# Altium schematic sheet PIC.SchDoc
size A
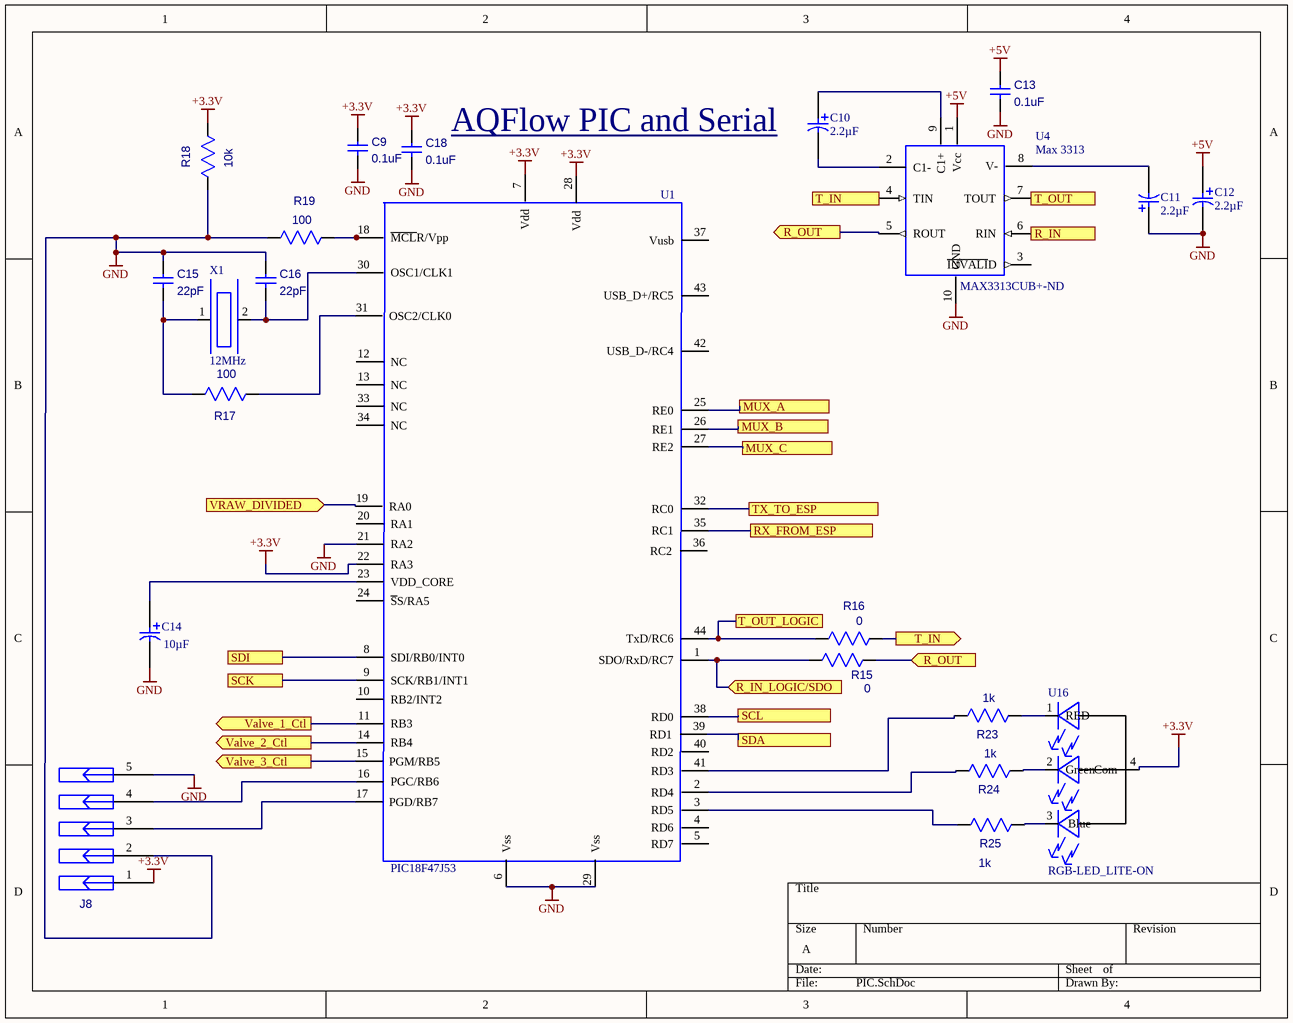
[diagram p0: PIC.SchDoc]

## Parts
C9  value 0.1uF  [CC1206]  (hidden comment: CC1206)
C10  Capacitance: 2.2µF  [Cap_Pol_0805]  (hidden comment: Cap_Pol_0805)
C11  Capacitance: 2.2µF  [Cap_Pol_0805]  (hidden comment: Cap_Pol_0805)
C12  Capacitance: 2.2µF  [Cap_Pol_0805]  (hidden comment: Cap_Pol_0805)
C13  value 0.1uF  [CC1206]  (hidden comment: CC1206)
C14  Capacitance: 10µF  [Cap_Pol_0805]  (hidden comment: CAP_POL_0805 Generic)
C15  value 22pF  [CC1206]  (hidden comment: CC1206)
C16  value 22pF  [CC1206]  (hidden comment: CC1206)
C18  value 0.1uF  [CC1206]  (hidden comment: CC1206)
J8  HDR_MTA_5X100  [HDR_MTA_5X100]  (value not drawn)
R15  value 0  [RC1206]  (hidden comment: RC1206)
R16  value 0  [RC1206]  (hidden comment: RC1206)
R17  value 100  [RC1206]  (hidden comment: RC1206)
R18  value 10k  [RC1206]  (hidden comment: RC1206)
R19  value 100  [RC1206]  (hidden comment: RC1206)
R23  value 1k  [RC1206]  (hidden comment: RC1206)
R24  value 1k  [RC1206]  (hidden comment: RC1206)
R25  value 1k  [RC1206]  (hidden comment: RC1206)
U1  PIC18F47J53  [44-TQFP]
U4  Max 3313  Supplier Part Number 1: MAX3313CUB+-ND  [uSOP]
U16  RGB-LED_LITE-ON  [LTST-C19HE1WT]
X1  12MHz  [XTAL_MINI_ABM3]

## Ports
MUX_A, MUX_B, MUX_C, R_IN (in), R_IN_LOGIC/SDO (in), R_OUT (in), R_OUT (out), RX_FROM_ESP, SCK, SCL, SDA, SDI, T_IN (in), T_IN (out), T_OUT (out), T_OUT_LOGIC, TX_TO_ESP, Valve_1_Ctl (out), Valve_2_Ctl (out), Valve_3_Ctl (out), VRAW_DIVIDED (in)

## Nets
+3.3V: C9.1 C18.1 J8.1 R18.1 U1.7(Vdd) U1.22(RA3) U1.28(Vdd) U16.4(Com)
+5V: C12.plus C13.1 U4.1(Vcc)
GND: C9.2 C11.plus C12.minus C13.2 C14.minus C15.1 C16.1 C18.2 J8.2 J8.5 R18.2 R19.1 U1.6(Vss) U1.21(RA2) U1.29(Vss) U4.10(GND)
MUX_A: U1.25(RE0) ; port MUX_A
MUX_B: U1.26(RE1) ; port MUX_B
MUX_C: U1.27(RE2) ; port MUX_C
R_IN: U4.6(RIN) ; port R_IN
R_IN_LOGIC/SDO: R15.1 U1.1(SDO/RxD/RC7) ; port R_IN_LOGIC/SDO
R_OUT: R15.2 U4.5(ROUT) ; port R_OUT
RX_FROM_ESP: U1.35(RC1) ; port RX_FROM_ESP
SCK: U1.9(SCK/RB1/INT1) ; port SCK
SCL: U1.38(RD0) ; port SCL
SDA: U1.39(RD1) ; port SDA
SDI: U1.8(SDI/RB0/INT0) ; port SDI
T_IN: R16.2 U4.4(TIN) ; port T_IN
T_OUT: U4.7(TOUT) ; port T_OUT
T_OUT_LOGIC: R16.1 U1.44(TxD/RC6) ; port T_OUT_LOGIC
TX_TO_ESP: U1.32(RC0) ; port TX_TO_ESP
Valve_1_Ctl: U1.11(RB3) ; port Valve_1_Ctl
Valve_2_Ctl: U1.14(RB4) ; port Valve_2_Ctl
Valve_3_Ctl: U1.15(PGM/RB5) ; port Valve_3_Ctl
VRAW_DIVIDED: U1.19(RA0) ; port VRAW_DIVIDED
NetC10_minus: C10.minus U4.2(C1-)
NetC10_plus: C10.plus U4.9(C1+)
NetC11_minus: C11.minus U4.8(V-)
NetC14_plus: C14.plus U1.23(VDD_CORE)
NetC15_2: C15.2 R17.1 X1.1
NetC16_2: C16.2 U1.30(OSC1/CLK1) X1.2
NetJ8_3: J8.3 U1.17(PGD/RB7)
NetJ8_4: J8.4 U1.16(PGC/RB6)
NetR17_2: R17.2 U1.31(OSC2/CLK0)
NetR19_2: R19.2 U1.18(~{MCL}R/Vpp)
NetR23_1: R23.1 U1.41(RD3)
NetR23_2: R23.2 U16.1(RED)
NetR24_1: R24.1 U1.2(RD4)
NetR24_2: R24.2 U16.2(Green)
NetR25_1: R25.1 U1.3(RD5)
NetR25_2: R25.2 U16.3(Blue)

Not connected (* = marked no-connect by the designer): U1 4(RD6) 5(RD7) 10(RB2/INT2) 12(NC) 13(NC) 20(RA1) 24(~{S}S/RA5) 33(NC) 34(NC) 36(RC2) 37(Vusb) 40(RD2) 42(USB_D-/RC4) 43(USB_D+/RC5); U4 3(~{INVALI}D)

## Notes on the sheet
- (near C10) AQFlow PIC and Serial

## Library data of the parts
C10-C12 = Cap_Pol_0805: Manufacturer: AVX Corporation; Manufacturer Part Number: TAJR225K020RNJ; Manufacturer Size Code: R; Tolerance: ±10%; Voltage - Rated: 20V; ESR (Equivalent Series Resistance): 6 Ohm; Type: Molded; Supplier 1: Digi-Key; RoHS: RoHS Compliant; Category: Capacitors; Stock 1: 9954; Pricing 1: 1=1.24, 10=1.034, 100=0.66, 250=0.55, 500=0.495, 1000=0.451 (USD); Packaging: Cut Tape (CT); Operating Temperature: -55°C ~ 125°C; Mounting Type: Surface Mount; Package / Case: 0805 (2012 Metric); Size / Dimension: 0.081" L x 0.051" W (2.05mm x 1.30mm); Height - Seated (Max): 0.047" (1.20mm); Lead Spacing: -; Features: General Purpose; Lifetime @ Temp.: -; ComponentLink1URL: http://www.avx.com/docs/Catalogs/tajlp.pdf; ComponentLink1Description: http://www.avx.com/docs/Catalogs/tajlp.pdf; Supplier Part Number 1: 478-4693-1-ND
C14 = CAP_POL_0805 Generic: Manufacturer: Rohm Semiconductor; Manufacturer Part Number: TCTP1C106M8R; Manufacturer Size Code: P; Tolerance: ±20%; Voltage - Rated: 16V; ESR (Equivalent Series Resistance): 6 Ohm; Type: Molded; Supplier 1: Digi-Key; Supplier Part Number 1: 511-1683-2-ND; RoHS: RoHS Compliant; Category: Capacitors; Stock 1: 99000; Pricing 1: 3000=0.2055, 6000=0.1918, 9000=0.18495, 15000=0.18221, 30000=0.1781, 75000=0.17468, 150000=0.16783 (USD); Packaging: Tape & Reel (TR); Operating Temperature: -55°C ~ 125°C; Mounting Type: Surface Mount; Package / Case: 0805 (2012 Metric); Size / Dimension: 0.079" L x 0.049" W (2.00mm x 1.25mm); Height - Seated (Max): 0.047" (1.20mm); Lead Spacing: -; Features: General Purpose; Lifetime @ Temp.: -; ComponentLink1URL: http://rohmfs.rohm.com/en/products/databook/datasheet/passive/tantalum_capacitor/tantalum_chip_capacitor/tct_p.pdf; ComponentLink1Description: http://rohmfs.rohm.com/en/products/databook/datasheet/passive/tantalum_capacitor/tantalum_chip_capacitor/tct_p.pdf
U1 = PIC18F47J53: PIC uController; Manufacturer: Microchip Technology; Manufacturer Part Number: PIC18F47J53T-I/PT; Core Size: 8-Bit; Speed: 48MHz; Connectivity: I²C, LIN, SPI, UART/USART, USB; Peripherals: Brown-out Detect/Reset, POR, PWM, WDT; Number of I/O: 34; Program Memory Size: 128KB (64K x 16); Program Memory Type: FLASH; RAM Size: 3.8K x 8; Voltage - Supply (Vcc/Vdd): 2.15 V ~ 3.6 V; Data Converters: A/D 13x10b/12b; Oscillator Type: Internal; Supplier 1: Digi-Key; Supplier Part Number 1: PIC18F47J53T-I/PT-ND; RoHS: RoHS Compliant; Category: Integrated Circuits (ICs); Stock 1: 0; Pricing 1: 1200=3.42999 (USD); Packaging: Tape & Reel (TR); Core Processor: PIC; EEPROM Size: -; Operating Temperature: -40°C ~ 85°C; Package / Case: 44-TQFP; Supplier Device Package: 44-TQFP (10x10); ComponentLink1URL: http://www.microchip.com/mymicrochip/filehandler.aspx?ddocname=en548986; ComponentLink1Description: http://www.microchip.com/mymicrochip/filehandler.aspx?ddocname=en548986
X1 = XTAL_MINI_ABM3
J8 = HDR_MTA_5X100: Value: *
U4 = Max 3313: Supplier 1: Digi-Key